# EAGLE schematic servodengen (EAGLE 9.6.2)
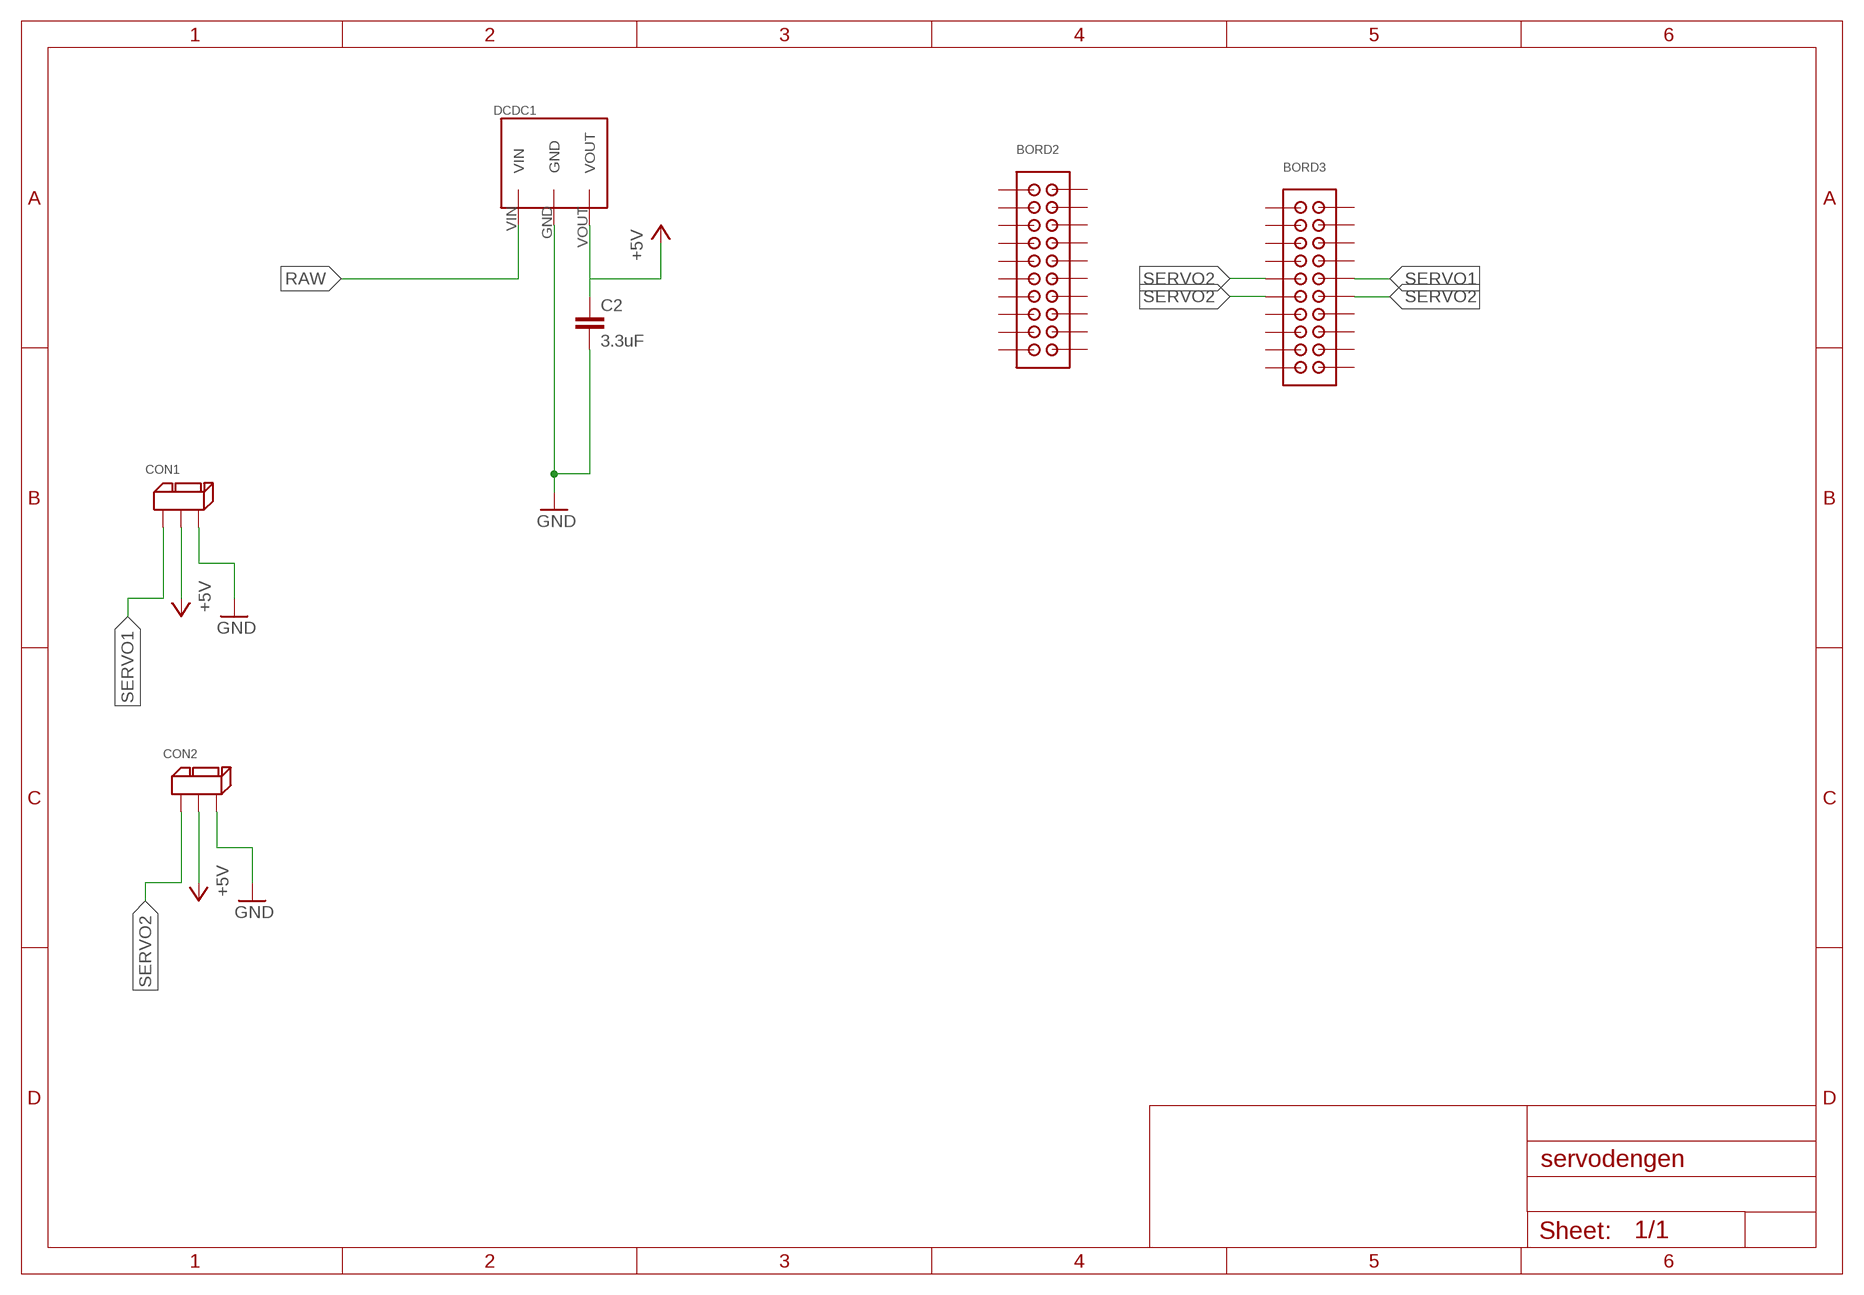
[diagram p0: schematic, sheet 1]

## Parts
BORD2  2X10  [2X10]
BORD3  2X10  [2X10]
C2  3.3uF  C-EU025-024X044  [C025-024X044]
CON1  3PIN  [3PIN]
CON2  3PIN  [3PIN]
DCDC1  5V1A_M78AR05-1  [5V1A_M78AR05-1]

## Nets
+5V: C2.1 CON1.P$2 CON2.P$2 DCDC1.VOUT
GND: C2.2 CON1.P$3 CON2.P$3 DCDC1.GND
RAW: DCDC1.VIN
SERVO1: BORD3.P$10 CON1.P$1
SERVO2: BORD3.P$9 BORD3.P$11 BORD3.P$12 CON2.P$1
Unconnected: BORD2.P$1 BORD2.P$2 BORD2.P$3 BORD2.P$4 BORD2.P$5 BORD2.P$6 BORD2.P$7 BORD2.P$8 BORD2.P$9 BORD2.P$10 BORD2.P$11 BORD2.P$12 BORD2.P$13 BORD2.P$14 BORD2.P$15 BORD2.P$16 BORD2.P$17 BORD2.P$18 BORD2.P$19 BORD2.P$20 BORD3.P$1 BORD3.P$2 BORD3.P$3 BORD3.P$4 BORD3.P$5 BORD3.P$6 BORD3.P$7 BORD3.P$8 BORD3.P$13 BORD3.P$14 BORD3.P$15 BORD3.P$16 BORD3.P$17 BORD3.P$18 BORD3.P$19 BORD3.P$20

## Library data of the parts
BORD2 BORD3 = PinSocket:2X10
C2 = rcl:C-EU: CAPACITOR, European symbol; SPICEPREFIX: C
CON1 CON2 = XR Connector:3PIN
DCDC1 = DC-DC:5V1A_M78AR05-1

## Net classes
0 default: width 0.406 mm